# EAGLE design eii-psu-thr-hole-psb-v1.1 (EAGLE 9.6.2)
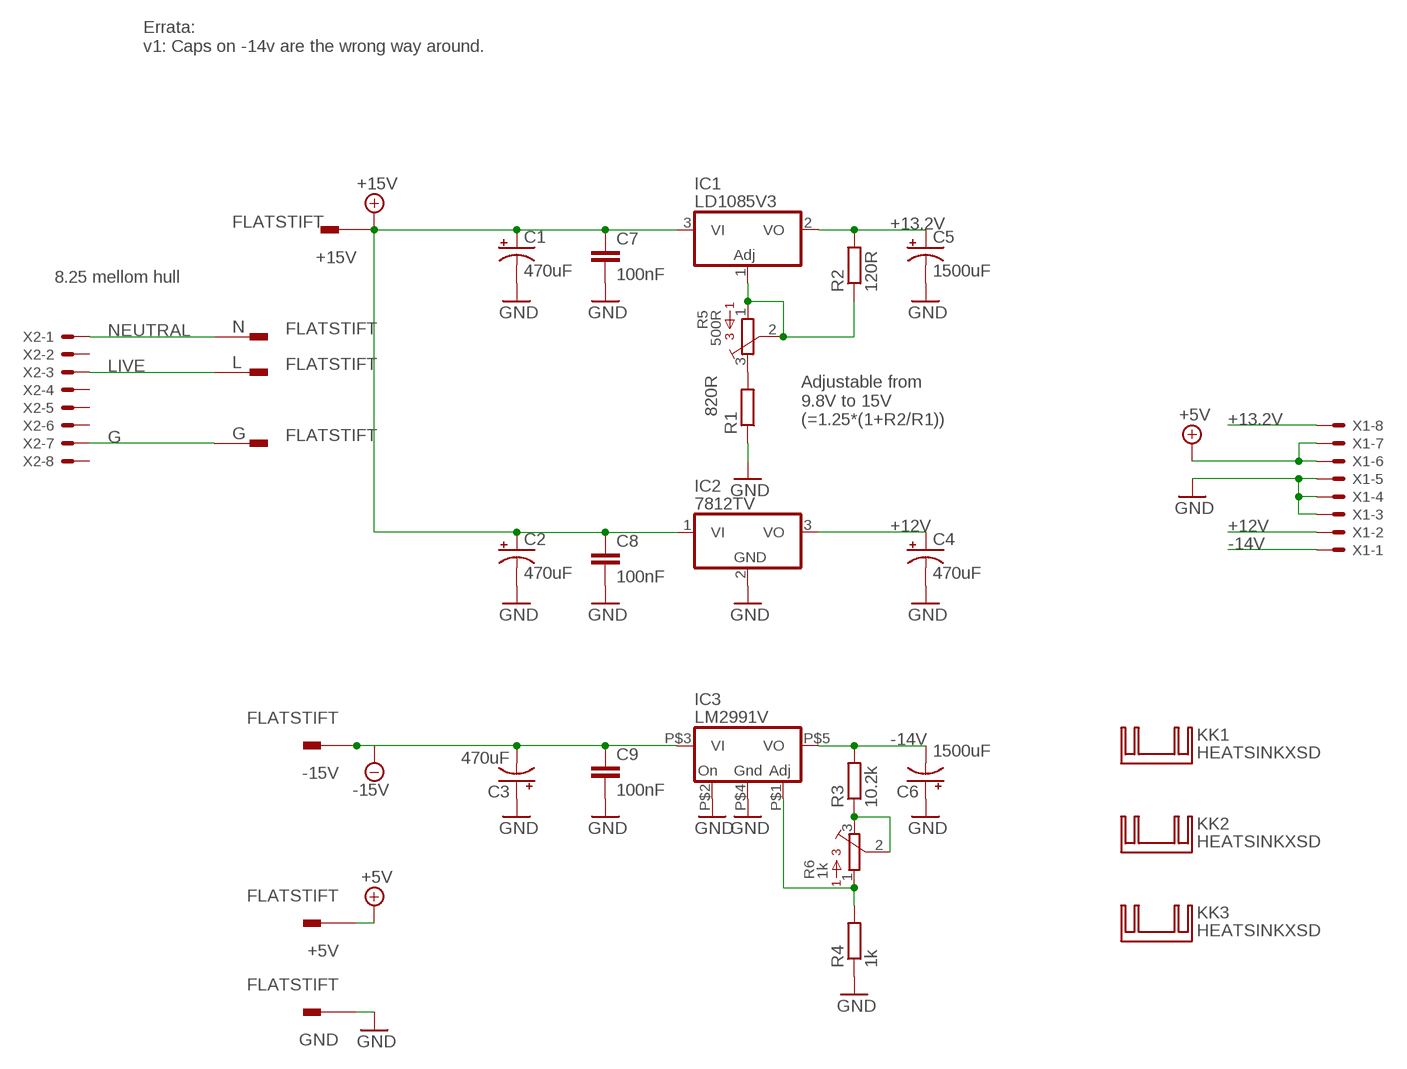
[diagram p0: schematic, sheet 1]

## Parts
+5V  FLATSTIFT  [FLATSTIFT]
+15V  FLATSTIFT  [FLATSTIFT]
-15V  FLATSTIFT  [FLATSTIFT]
C1  470uF  CPOL-USE5-10.5  [E5-10,5]
C2  470uF  CPOL-USE5-10.5  [E5-10,5]
C3  470uF  CPOL-USE5-10.5  [E5-10,5]
C4  470uF  CPOL-USE5-10.5  [E5-10,5]
C5  1500uF  CPOL-USE5-13  [E5-13]
C6  1500uF  CPOL-USE5-13  [E5-13]
C7  100nF  C-EU050-030X075  [C050-030X075]
C8  100nF  C-EU050-030X075  [C050-030X075]
C9  100nF  C-EU050-030X075  [C050-030X075]
G  FLATSTIFT  [FLATSTIFT]
GND  FLATSTIFT  [FLATSTIFT]
IC1  LD1085V3  [TO220V-J]
IC2  7812TV  [TO220V]
IC3  LM2991V  [TO220-5V-J]
KK1  HEATSINKXSD  [XSD1226-005]
KK2  HEATSINKXSD  [XSD1226-005]
KK3  HEATSINKXSD  [XSD1226-005]
L  FLATSTIFT  [FLATSTIFT]
N  FLATSTIFT  [FLATSTIFT]
R1  820R  R-EU_0207/7  [0207/7]
R2  120R  R-EU_0207/7  [0207/7]
R3  10.2k  R-EU_0207/7  [0207/7]
R4  1k  R-EU_0207/7  [0207/7]
R5  500R  3362P  [3362P]
R6  1k  3362P  [3362P]
X1  KK-156-8  [KK-156-8]
X2  KK-156-8  [KK-156-8]

## Nets
+5V: +5V.F +5V.F2 X1.6 X1.7
+12V: C4.+ IC2.3(VO) X1.2
+13.2V: C5.+ IC1.2(VO) R2.2 X1.8
+15V: +15V.F +15V.F2 C1.+ C2.+ C7.1 C8.1 IC1.3(VI) IC2.1(VI)
-14V: C6.- IC3.P$5(VO) R3.2 X1.1
-15V: -15V.F -15V.F2 C3.- C9.1 IC3.P$3(VI)
G: G.F G.F2 X2.7
GND: C1.- C2.- C3.+ C4.- C5.- C6.+ C7.2 C8.2 C9.2 GND.F GND.F2 IC2.2(GND) IC3.P$2(ON) IC3.P$4(GND) R1.1 R4.1 X1.3 X1.4 X1.5
LIVE: L.F L.F2 X2.3
N$1: R1.2 R5.3
N$2: IC1.1(ADJ) R2.1 R5.1 R5.2
N$5: R3.1 R6.2 R6.3
N$6: IC3.P$1(ADJ) R4.2 R6.1
NEUTRAL: N.F N.F2 X2.1
Unconnected: X2.2 X2.4 X2.5 X2.6 X2.8

## Notes on the sheet
- Errata:
  v1: Caps on -14v are the wrong way around.
- 8.25 mellom hull
- Adjustable from
  9.8V to 15V
  (=1.25*(1+R2/R1))

## Library data of the parts
+5V +15V -15V G GND L N = joakim:FLATSTIFT: Flatstift https://datasheet.lcsc.com/lcsc/1810181718_TE-Connectivity-63849-1_C86469.pdf JLCPCB: C86469, found under Connectors/Terminals
C1-C6 = rcl:CPOL-US: POLARIZED CAPACITOR, American symbol; SPICEPREFIX: C
C7-C9 = rcl:C-EU: CAPACITOR, European symbol; SPICEPREFIX: C
IC1 = joakim:LD1085V
IC2 = linear:78*: Positive VOLTAGE REGULATOR Source: http://cache.national.com/ds/LM/LM78L05.pdf http://www.fairchildsemi.com/ds/LM/LM7805.pdf
IC3 = joakim:LM2991
KK1-KK3 = joakim:HEATSINK: TO-220 Heatsinks
R1-R4 = rcl:R-EU_: RESISTOR, European symbol; SPICEPREFIX: R
R5 R6 = bourns:3362: 3362 Series 1/4" Square Trimmer
X1 X2 = con-molex:KK-156-8: KK 156 HEADER Source: http://www.molex.com/pdm_docs/sd/026604100_sd.pdf; MF: MOLEX; OC_FARNELL: unknown; OC_NEWARK: unknown

## Board
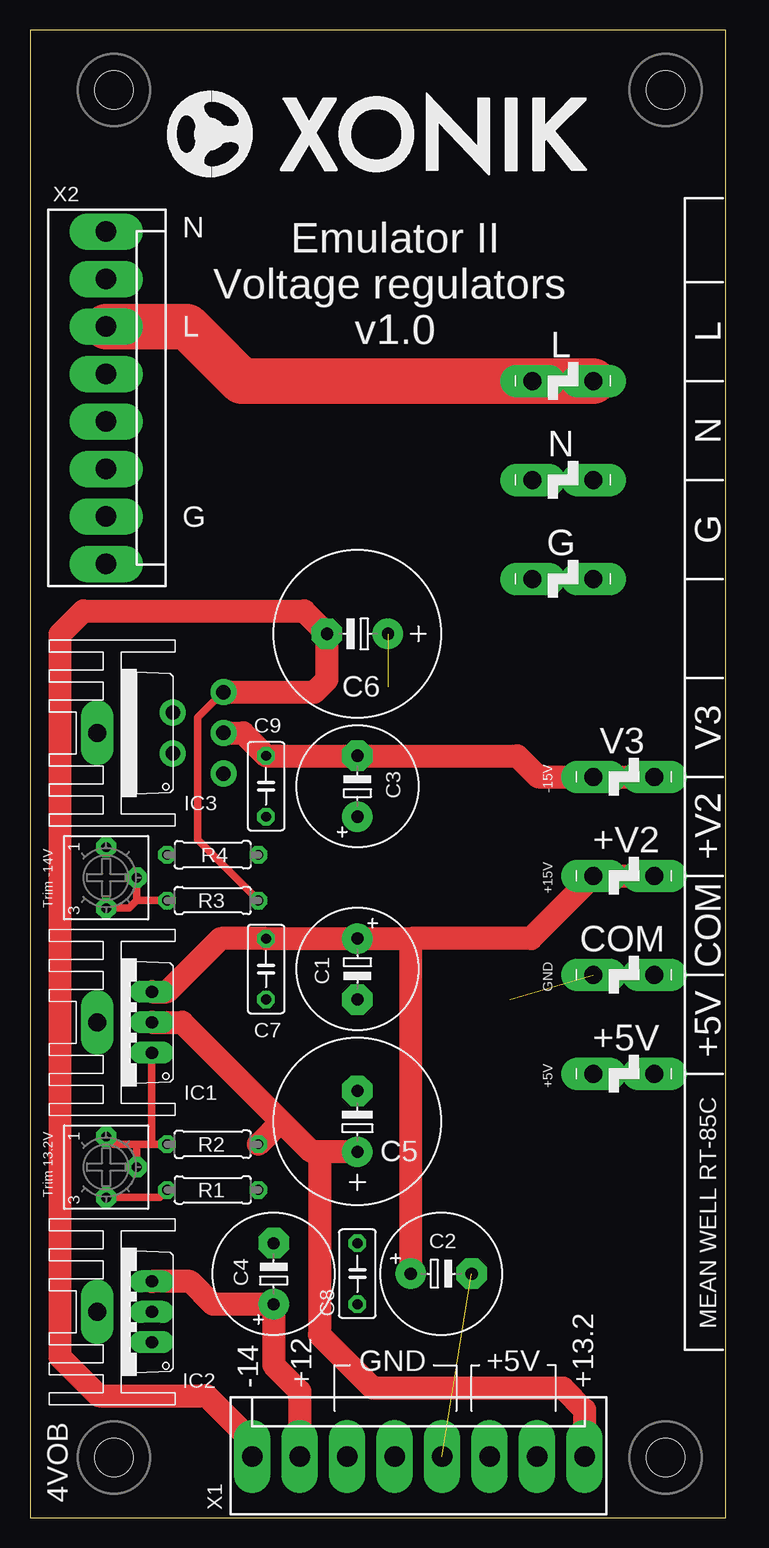
[diagram p1: board, top side]
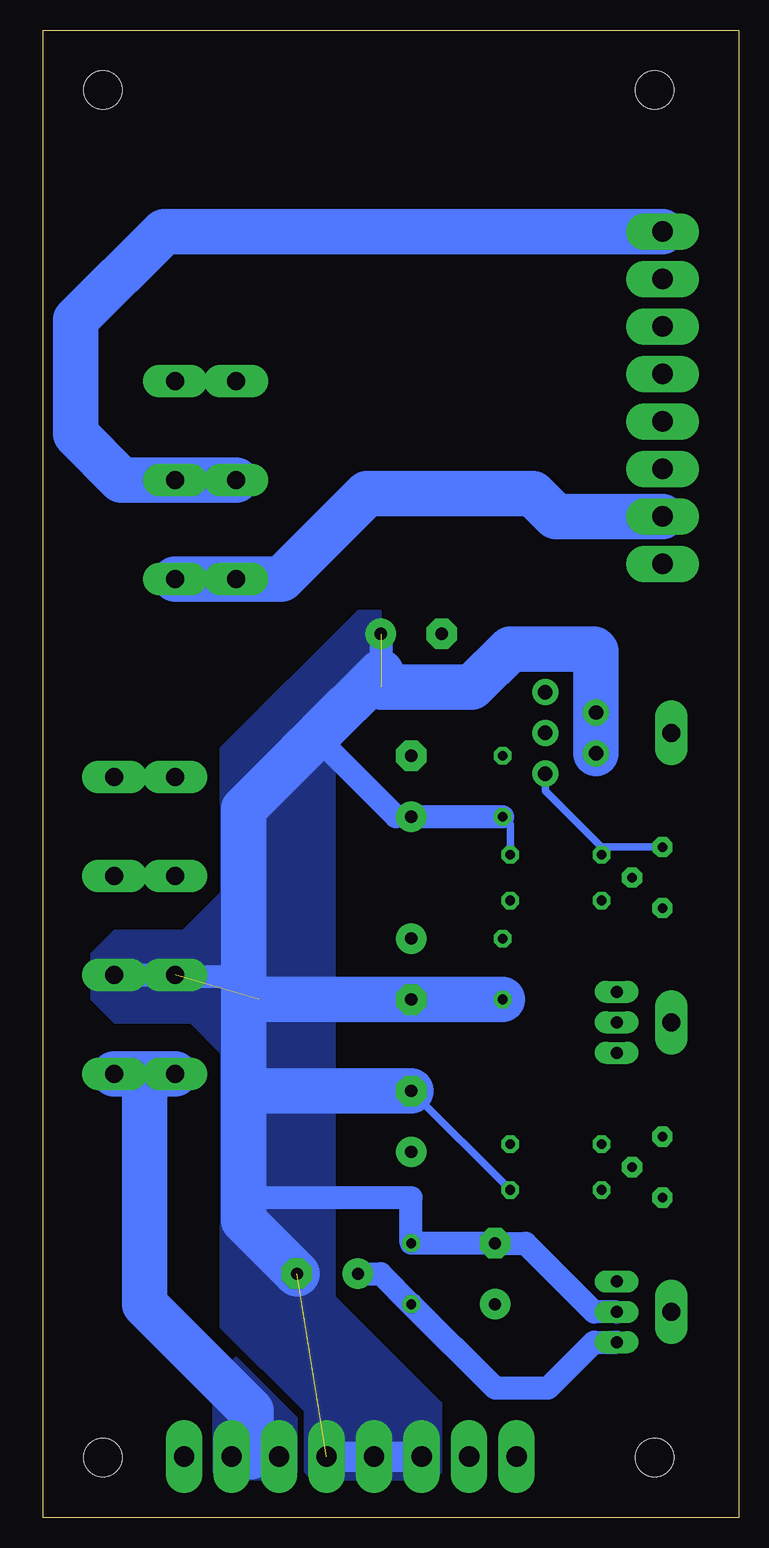
[diagram p2: board, bottom side, seen from below]

Size 58 x 124 mm. Coordinates in mm from the lower left corner, seen from the top.
Outline: 0,0 58,0 58,124 0,124 0,0
Copper layers (1*16): Top 0.035mm / dielectric 1.6mm / Bottom 0.035mm
Design rules "jlcpcb-2layers": minimum track width 5mil, minimum drill 0.3mm, track to track 5mil, track to pad 5mil, pad to pad 5mil, via to via 5mil, smd to smd 5mil, copper to edge 0.2mm, drill to drill 6mil, minimum pad ring 10mil, minimum via ring 3mil, stop-mask expansion 4mil, vias tented up to drill 0mil, thermal gap 10mil
Holes 3.2 mm at 7,119 53,119 53,5 7,5

### Footprints (pad centres in the part's own frame; a part is rotated, then mirrored left to right if it is on the bottom)
FLATSTIFT = drill 1.5 long: F -2.54,0; F2 2.54,0
E5-10,5 = drill 1.016 pad 2.54: + -2.54,0 | drill 1.016 pad 2.54 octagon: - 2.54,0
E5-13 = drill 1.016 pad 2.54: + -2.54,0 | drill 1.016 pad 2.54 octagon: - 2.54,0
C050-030X075 = drill 0.813 octagon: 1 -2.54,0; 2 2.54,0
TO220V-J = drill 1.016 long: 1 -2.54,-2.54; 2 0,-2.54; 3 2.54,-2.54
TO220V = drill 1.016 long: 1 -2.54,-2.54; 2 0,-2.54; 3 2.54,-2.54
TO220-5V-J = drill 1.2: P$1 -3.4,-8.51; P$2 -1.7,-4.28; P$3 0,-8.51; P$4 1.7,-4.28; P$5 3.4,-8.51
XSD1226-005 = drill 1.5 long: H 0,2
0207/7 = drill 0.813 octagon: 1 -3.81,0; 2 3.81,0
3362P = drill 0.813 pad 1.676 octagon: 1 -2.54,0; 2 0,2.54; 3 2.54,0
KK-156-8 = drill 1.7 pad 2.184 long: 1 -13.86,0; 2 -9.9,0; 3 -5.94,0; 4 -1.98,0; 5 1.98,0; 6 5.94,0; 7 9.9,0; 8 13.86,0

### Placement (x,y rotation side)
+5V  49.53,37 180 top
+15V  49.53,53.5 0 top
-15V  49.53,61.75 0 top
C1  27.3,45.72 270 top
C2  34.29,20.32 0 top
C3  27.3,60.96 90 top
C4  20.32,20.32 90 top
C5  27.3,33.02 90 top
C6  27.3,73.66 180 top
C7  19.68,45.72 270 top
C8  27.3,20.32 90 top
C9  19.68,60.96 270 top
G  44.45,78.25 0 top
GND  49.53,45.25 180 top
IC1  7.62,41.27 90 top
IC2  7.62,17.14 90 top
IC3  7.62,65.41 90 top
KK1  7.62,65.41 90 top
KK2  7.62,41.27 90 top
KK3  7.62,17.14 90 top
L  44.45,94.75 0 top
N  44.45,86.5 0 top
R1  15.24,27.3 180 top
R2  15.24,31.11 0 top
R3  15.24,51.44 0 top
R4  15.24,55.24 180 top
R5  6.35,29.21 270 top
R6  6.35,53.34 270 top
U$3  [XONIK_LOGO_35]  11.43,111.76 0 top
X1  32.38,5.08 0 top
X2  6.35,93.34 270 top

### Tracks (layer width: path | path; a pad name or v marks a point on that pad's centre or on a via)
+5V
  Bottom 3.81: +5V.F2 49.53,37 | 49.53,37 +5V.F | 40.64,5.08 40.64,8.89 49.53,17.78 49.53,37
  pour Bottom (no thermals): 36.83,3.81 36.83,8.26 41.91,13.34 44.45,10.79 43.81,10.16 43.81,3.81 43.18,3.17 37.47,3.17
+12V
  Top 1.905: X1.2 22.48,10.54 20.32,12.7 C4.+ 15.24,17.78 13.34,19.68 IC2.3
+13.2V
  Top 1.905: X1.8 46.24,9 44.45,10.79 28.57,10.79 24.13,15.24 24.13,30.48 C5.+ 23.5,30.48 20.95,33.02 | R2.2 20.95,33.02 | IC1.2 12.7,41.27 20.95,33.02
+15V
  Top 1.905: IC1.3 11.43,43.81 15.88,48.26 C7.1 C1.+ 31.75,48.26 | C2.+ 31.75,48.26 | 31.75,48.26 41.79,48.26 +15V.F +15V.F2
  Bottom 1.905: IC2.1 12.06,14.61 15.88,10.79 20.32,10.79 C8.1 29.84,20.32 C2.+
-14V
  Top 0.61: R3.2 13.97,56.52 13.97,66.67 16.1,68.81 IC3.P$5
  Top 1.905: X1.1 18.52,6.35 14.71,10.16 5.71,10.16 2.49,13.39 2.49,73.61 4.45,75.56 22.86,75.56 C6.- 24.77,69.85 23.72,68.81 IC3.P$5
-15V
  Top 1.905: IC3.P$3 17.78,65.41 C9.1 C3.- 40.64,63.5 42.39,61.75 -15V.F -15V.F2
G
  Bottom 3.81: X2.7 15.24,83.44 17.14,85.35 31,85.35 38.1,78.25 G.F G.F2
GND  (3 unrouted)
  Bottom 0.61: C5.- R1.1 | R4.1 19.05,57.78 C9.2
  Bottom 1.905: IC2.2 12.06,17.14 17.78,22.86 C4.- C8.2 27.3,26.67 41.27,26.67 | GND.F GND.F2 46.87,45.09 41.27,45.09 | C9.2 C3.+ 28.57,58.42 35.24,65.09 | C6.+ 29.84,70.48
  Bottom 2.54: X1.3 X1.4 X1.5
  Bottom 3.81: 41.27,35.56 41.27,45.09 41.27,59.05 35.24,65.09 29.84,70.48 | IC3.P$2 IC3.P$4 11.9,72.22 12.06,72.39 19.05,72.39 22.23,69.22 29.84,69.22 | C5.- 41.27,35.56 | C7.2 C1.- 40.01,43.18 | 41.27,35.56 41.27,26.67 41.27,24.77 C2.-
  pour Bottom (no thermals): 24.77,3.81 24.77,9.53 33.66,18.41 33.66,68.58 29.84,68.58 29.84,75.56 31.75,75.56 43.18,64.14 43.18,52.07 46.35,48.9 52.07,48.9 53.98,46.99 53.98,43.18 52.07,41.27 45.72,41.27 43.18,38.73 43.18,15.88 36.2,8.89 36.2,3.81 35.56,3.17 25.4,3.17
LIVE
  Top 3.81: L.F2 L.F 17.64,94.75 13.11,99.28 X2.3
N$1
  Top 0.61: R5.3 10.79,26.67 R1.2
N$2
  Top 0.61: R5.2 8.89,31.11 | R5.1 6.99,31.11 8.89,31.11 | 8.89,31.11 R2.1 10.16,31.11 IC1.1
N$5
  Top 0.61: R6.2 8.89,51.44 R3.1
  Top 0.635: 8.89,51.44 8.26,50.8 R6.3
N$6
  Bottom 0.61: IC3.P$1 16.13,60.58 11.43,55.88 | R6.1 11.43,55.88 | 11.43,55.88 R4.2
NEUTRAL
  Bottom 3.81: X2.1 47.91,107.2 55.28,99.83 55.28,90.31 51.48,86.5 N.F N.F2

### Text on the board
tNames: N | Emulator II / Voltage regulators / v1.0 | L | L | L | N | N | G | G | G | V3 | V3 | -15V | +V2 | +V2 | +15V | Trim -14V | COM | COM | GND | +5V | +5V | +5V | Trim 13.2V | MEAN WELL RT-85C | GND | +5V | -14 | +12 | +13.2 | 4VOB